# Altium project HLib-SPIDevices.PrjPcb
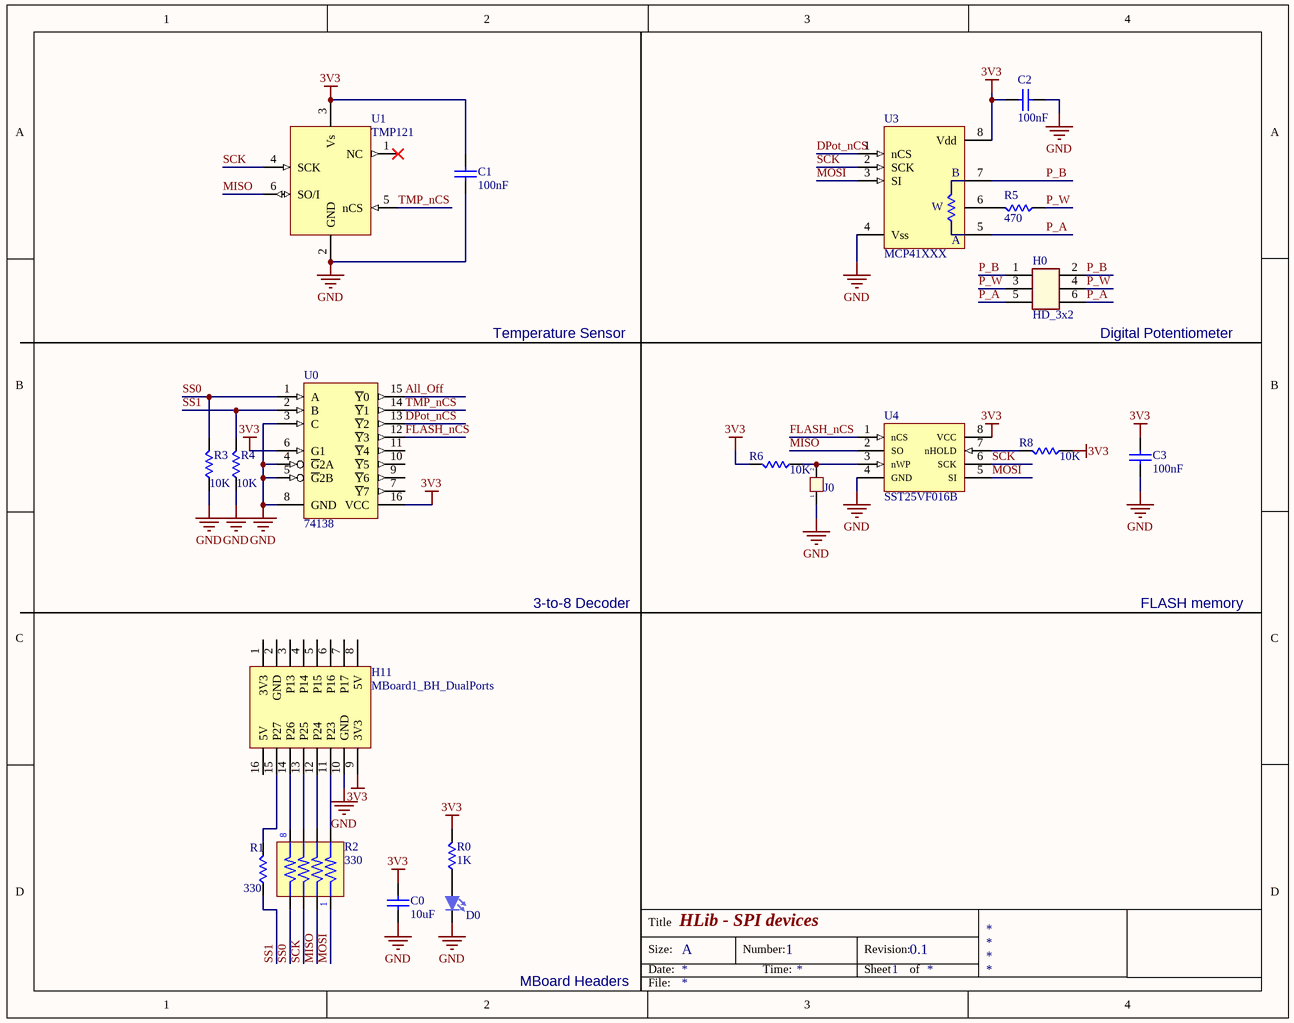
[diagram p0: HLib-SPIDevices.SchDoc]
1 sheet, 20 parts. Net scope: hierarchical (ports join the sheet entries above them; power ports are global).
Board file: PCB1.PcbDoc

## Sheet HLib-SPIDevices.SchDoc: HLib - SPI devices
size A; DrawnBy: Nhat Pham; DocumentNumber: 1; Revision: 0.1; SheetNumber: 1; DocumentName: HLib - SPI devices; ProjectName: HLib

### Parts
C0  value 10uF  [SM_0805_C_CERAMIC]  (hidden comment: C_Ceramic)
C1  value 100nF  [SM_0805_C_CERAMIC]  (hidden comment: C_Ceramic)
C2  value 100nF  [SM_0805_C_CERAMIC]  (hidden comment: C_Ceramic)
C3  value 100nF  [SM_0805_C_CERAMIC]  (hidden comment: C_Ceramic)
D0  LED  [SM_0805_LED]  (value not drawn)
H0  HD_3x2  [HD_male_3x2_100mil_straight]
H11  MBoard1_BH_DualPorts  [MBoard1_BH_DualPorts]
J0  Jumper 2  [HD_MALE_2_100mil_straight]  (value not drawn)
R0  value 1K  [SM_0805_R]  (hidden comment: R)
R1  value 330  [SM_0805_R]  (hidden comment: R)
R2  330  [RA4]
R3  value 10K  [SM_0805_R]  (hidden comment: R)
R4  value 10K  [SM_0805_R]  (hidden comment: R)
R5  value 470  [SM_0805_R]
R6  value 10K  [SM_0805_R]
R8  value 10K  [SM_0805_R]
U0  74138  [SO-16]
U1  TMP121  [SC70-6]
U3  MCP41XXX  [SO-8]
U4  SST25VF016B  [SO-8]

### Nets
3V3: C0.2 C1.2 C2.2 C3.1 H11.9(3V3) R0.2 R6.2 R8.1 U0.6(G1) U0.16(VCC) U1.3(Vs) U3.8(Vdd) U4.8(VCC)
GND: C0.1 C1.1 C2.1 C3.2 D0.2(K) H11.10(GND) J0.1 R3.1 R4.1 U0.3(C) U0.4(~{G}2A) U0.5(~{G}2B) U0.8(GND) U1.2(GND) U3.4(Vss) U4.4(GND)
All_Off: U0.15(~{Y}0)
DPot_nCS: U0.13(~{Y}2) U3.1(nCS)
FLASH_nCS: U0.12(~{Y}3) U4.1(nCS)
MISO: R2.3 U1.6(SO/I) U4.2(SO)
MOSI: R2.1 U3.3(SI) U4.5(SI)
P_A: H0.5 H0.6 U3.5(PA0)
P_B: H0.1 H0.2 U3.7(PB0)
P_W: H0.3 H0.4 R5.1
SCK: R2.5 U1.4(SCK) U3.2(SCK) U4.6(SCK)
SS0: R2.7 R3.2 U0.1(A)
SS1: R1.1 R4.2 U0.2(B)
TMP_nCS: U0.14(~{Y}1) U1.5(nCS)
NetD0_1: D0.1(A) R0.1
NetH11_11: H11.11(P23) R2.2
NetH11_12: H11.12(P24) R2.4
NetH11_13: H11.13(P25) R2.6
NetH11_14: H11.14(P26) R2.8
NetH11_15: H11.15(P27) R1.2
NetJ0_2: J0.2 R6.1 U4.3(nWP)
NetR5_2: R5.2 U3.6(PW0)
NetR8_2: R8.2 U4.7(nHOLD)

Not connected (* = marked no-connect by the designer): H11 1(3V3) 2(GND) 3(P13) 4(P14) 5(P15) 6(P16) 7(P17) 8(5V) 16(5V); U0 7(~{Y}7) 9(~{Y}6) 10(~{Y}5) 11(~{Y}4); U1 1(NC)*

### Notes on the sheet
- Temperature Sensor
- (near H0) Digital Potentiometer
- 3-to-8 Decoder
- FLASH memory
- MBoard Headers
- Title
- Size:
- Date:
- A
- Number:
- Time:
- Revision:
- Sheet
- of
- File:
- (in symbol MCP41XXX) B; W; A

### Library data of the parts
C0-C3 = C_Ceramic: Non-polarity ceramic capacitor; Published: 8-Jun-2000; LatestRevisionDate: 17-Jul-2002; LatestRevisionNote: Re-released for DXP Platform.; PackageReference: RAD-0.3; Publisher: Altium Limited; PackageDescription: Radial Cap, Thru-Hole; 2 Leads; 0.3 in Pin Spacing
H0 = HD_3x2: Header, 3-pins/row, double row,
J0 = JP 2: Value: JP 2
R0 R1 R3-R6 R8 = R: Resistor; Published: 8-Jun-2000; LatestRevisionDate: 29-May-2009; LatestRevisionNote: IPC-7351 Footprint Added.; PackageReference: J1-0603; Publisher: Altium Limited; PackageDescription: Chip Resistor
R2 = RA4
U0 = 74138: 3 -to- 8 Decoder - Out Low; Value: 74138; Copyright by: VanDungEvn@Gmail.com
D0 = LED: Published: 8-Jun-2000; LatestRevisionDate: 08-Jul-2005; LatestRevisionNote: Mech Layer 1 removed.; PackageReference: LED-1; Publisher: Altium Limited; PackageDescription: LED; 2 Leads